# EAGLE design Xonik Noise A6 w.logo v2.1-12v (EAGLE 9.6.2)
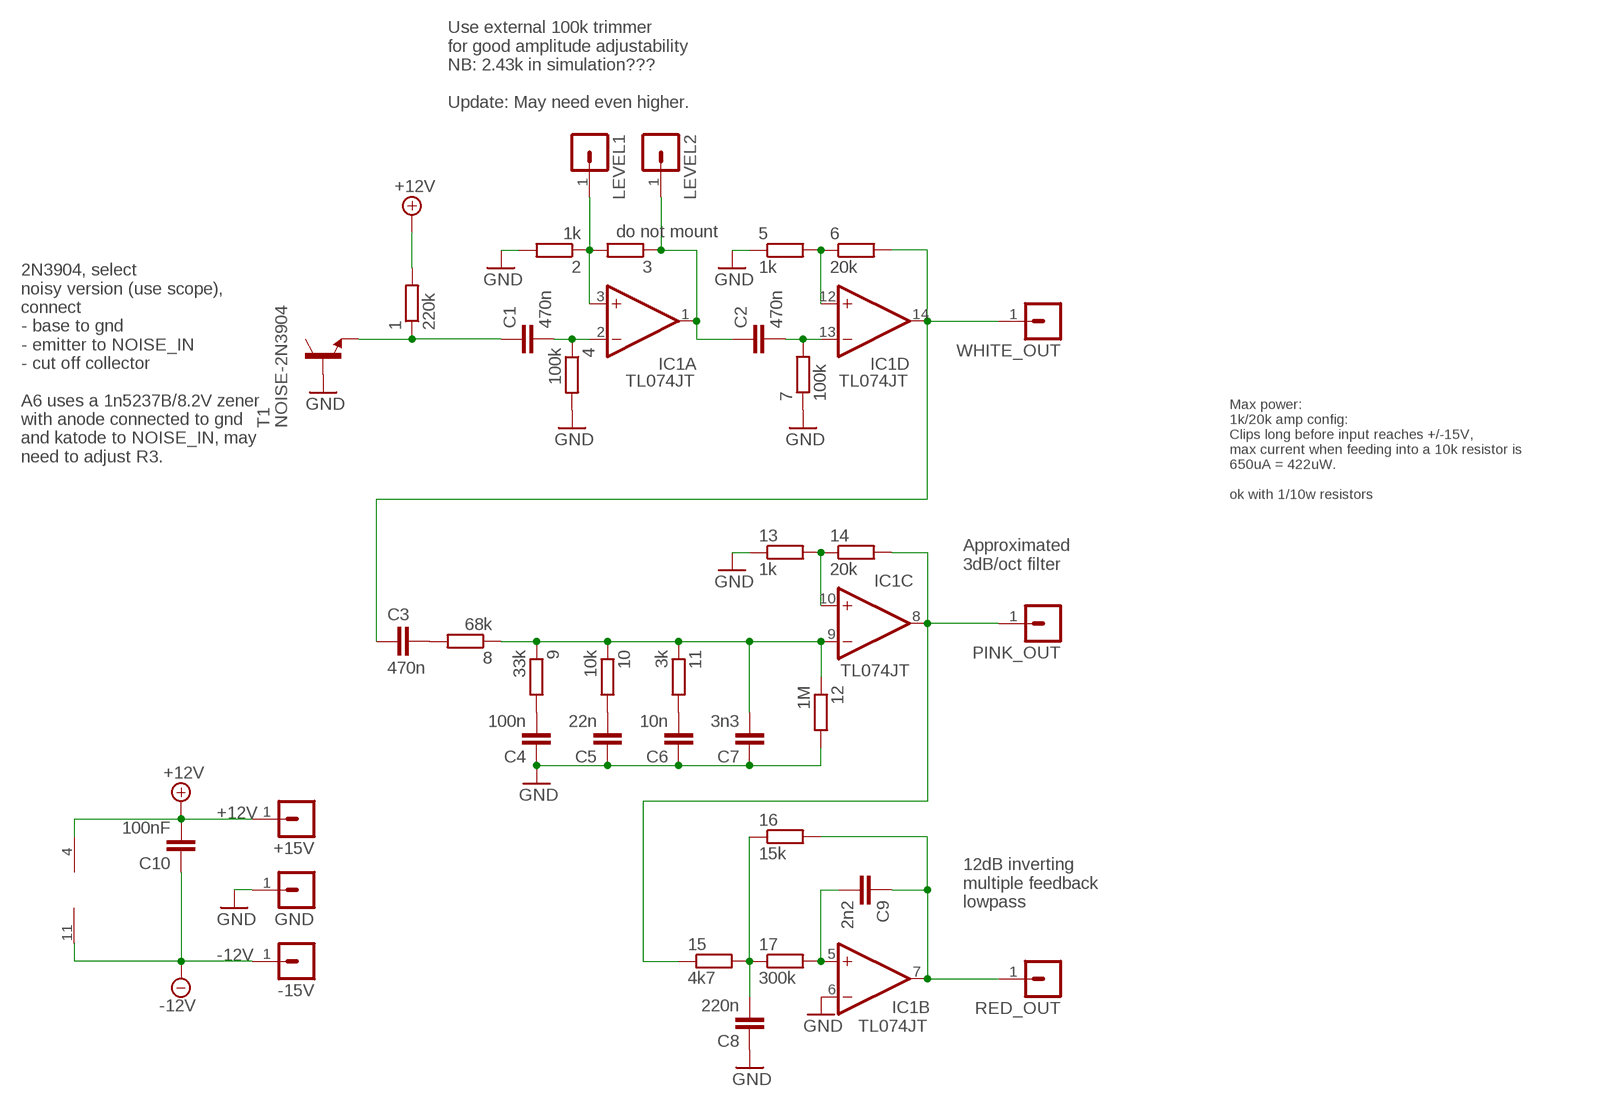
[diagram p0: schematic, sheet 1]

## Parts
1  220k  R-EU_R0603  [R0603]
2  1k  R-EU_R0603  [R0603]
3  do not mount  R-EU_R0603  [R0603]
4  100k  R-EU_R0603  [R0603]
5  1k  R-EU_R0603  [R0603]
6  20k  R-EU_R0603  [R0603]
7  100k  R-EU_R0603  [R0603]
8  68k  R-EU_R0603  [R0603]
9  33k  R-EU_R0603  [R0603]
10  10k  R-EU_R0603  [R0603]
11  3k  R-EU_R0603  [R0603]
12  1M  R-EU_R0603  [R0603]
13  1k  R-EU_R0603  [R0603]
14  20k  R-EU_R0603  [R0603]
15  4k7  R-EU_R0603  [R0603]
16  15k  R-EU_R0603  [R0603]
17  300k  R-EU_R0603  [R0603]
+15V  MA01-1JP  [SIP-PIN01-1J]
-15V  MA01-1JP  [SIP-PIN01-1J]
C1  470n  C-EUC0603  [C0603]
C2  470n  C-EUC0603  [C0603]
C3  470n  C-EUC0603  [C0603]
C4  100n  C-EUC0603  [C0603]
C5  22n  C-EUC0603  [C0603]
C6  10n  C-EUC0603  [C0603]
C7  3n3  C-EUC0603  [C0603]
C8  220n  C-EUC0603  [C0603]
C9  2n2  C-EUC0603  [C0603]
C10  100nF  C-EUC0603  [C0603]
GND  MA01-1JP  [SIP-PIN01-1J]
IC1  TL074JT  [TSSOP14J]
LEVEL1  MA01-1JP  [SIP-PIN01-1J]
LEVEL2  MA01-1JP  [SIP-PIN01-1J]
PINK_OUT  MA01-1JP  [SIP-PIN01-1J]
RED_OUT  MA01-1JP  [SIP-PIN01-1J]
T1  NOISE-2N3904  [NOISE-2N3904-J]
WHITE_OUT  MA01-1JP  [SIP-PIN01-1J]

## Nets
+12V: 1.2 +15V.1 C10.2 IC1.4(P:V+)
-12V: -15V.1 C10.1 IC1.11(P:V-)
GND: 2.2 4.2 5.1 7.1 12.2 13.1 C4.1 C5.1 C6.1 C7.1 C8.1 GND.1 IC1.6(B:-IN) T1.B
N$1: 2.1 3.2 IC1.3(A:+IN) LEVEL1.1
N$2: 5.2 6.1 IC1.12(D:+IN)
N$3: 13.2 14.1 IC1.10(C:+IN)
N$4: 9.2 C4.2
N$5: 10.2 C5.2
N$6: 11.2 C6.2
N$7: 1.1 C1.1 T1.E
N$8: 4.1 C1.2 IC1.2(A:-IN)
N$9: 3.1 C2.1 IC1.1(A:OUT) LEVEL2.1
N$10: 7.2 C2.2 IC1.13(D:-IN)
N$11: 6.2 C3.1 IC1.14(D:OUT) WHITE_OUT.1
N$12: 8.1 9.1 10.1 11.1 12.1 C7.2 IC1.9(C:-IN)
N$13: 8.2 C3.2
N$14: 14.2 15.1 IC1.8(C:OUT) PINK_OUT.1
N$16: 15.2 16.1 17.1 C8.2
N$17: 17.2 C9.2 IC1.5(B:+IN)
N$18: 16.2 C9.1 IC1.7(B:OUT) RED_OUT.1

## Notes on the sheet
- Use external 100k trimmer 
  for good amplitude adjustability
  NB: 2.43k in simulation???
  
  Update: May need even higher.
- 2N3904, select
  noisy version (use scope),
  connect 
  - base to gnd
  - emitter to NOISE_IN
  - cut off collector
  
  A6 uses a 1n5237B/8.2V zener
  with anode connected to gnd 
  and katode to NOISE_IN, may
  need to adjust R3.
- Max power:
  1k/20k amp config:
  Clips long before input reaches +/-15V,
  max current when feeding into a 10k resistor is
  650uA = 422uW. 
  
  ok with 1/10w resistors
- Approximated
  3dB/oct filter
- 12dB inverting
  multiple feedback
  lowpass

## Library data of the parts
1-17 = rcl:R-EU_: RESISTOR, European symbol; SPICEPREFIX: R
+15V -15V GND LEVEL1 LEVEL2 PINK_OUT RED_OUT WHITE_OUT = joakim:MA01-1J: PIN HEADER
C1-C10 = rcl:C-EU: CAPACITOR, European symbol; SPICEPREFIX: C
IC1 = joakim:TL074J: OP AMP
T1 = joakim:NOISE-2N3904: 2N3904 with the collector cut, used as a noise source

## Board
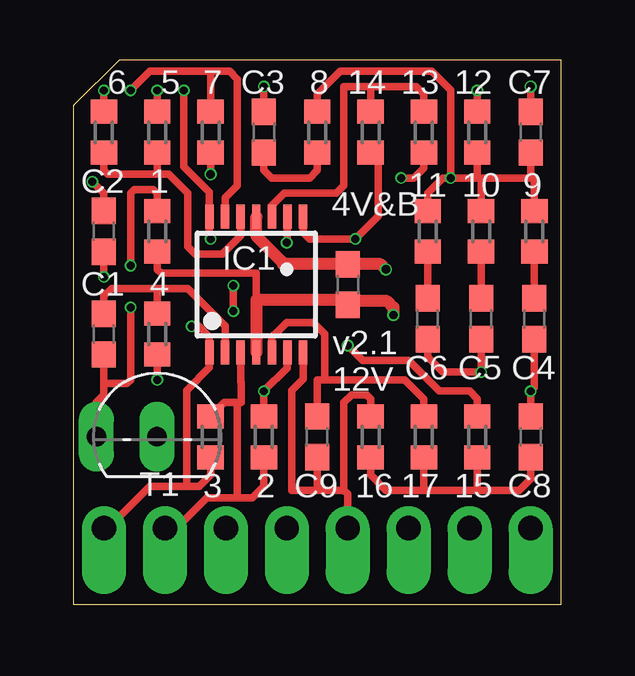
[diagram p1: board, top side]
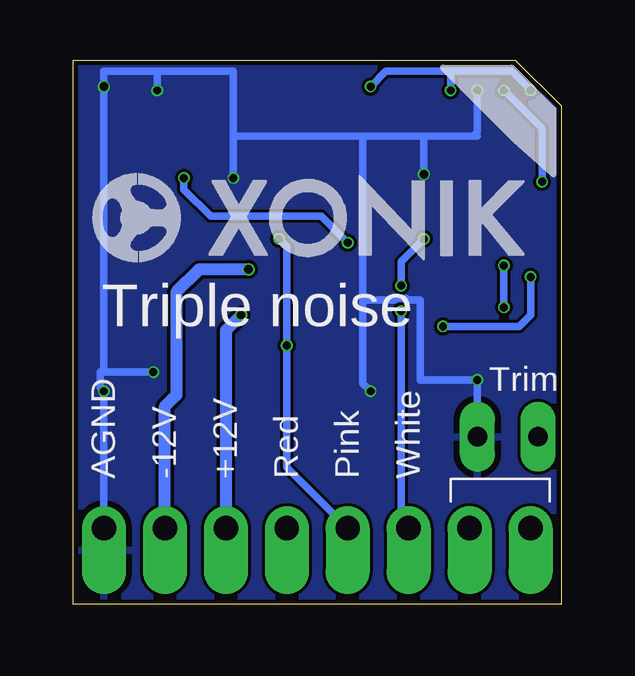
[diagram p2: board, bottom side, seen from below]

Size 20.32 x 22.7 mm. Coordinates in mm from the lower left corner, seen from the top.
Outline: 0,0 20.32,0 20.32,22.7 1.91,22.7 0,20.8 0,0
Copper layers (1*16): Top 0.035mm / dielectric 1.6mm / Bottom 0.035mm
Design rules "jlcpcb-2layers": minimum track width 5mil, minimum drill 0.3mm, track to track 5mil, track to pad 5mil, pad to pad 5mil, via to via 5mil, smd to smd 5mil, copper to edge 0.2mm, drill to drill 6mil, minimum pad ring 10mil, minimum via ring 3mil, stop-mask expansion 4mil, vias tented up to drill 0mil, thermal gap 10mil

### Footprints (pad centres in the part's own frame; a part is rotated, then mirrored left to right if it is on the bottom)
R0603 = smd 1 x 1.1: 1 -0.85,0; 2 0.85,0
SIP-PIN01-1J = drill 1.016 offset: 1 0,0
C0603 = smd 1.1 x 1: 1 -0.85,0; 2 0.85,0
TSSOP14J = smd 0.35 x 1: 1 -1.95,-2.825; 2 -1.3,-2.825; 3 -0.65,-2.825; 4 0,-2.825; 5 0.65,-2.825; 6 1.3,-2.825; 7 1.95,-2.825; 8 1.95,2.825; 9 1.3,2.825; 10 0.65,2.825; 11 0,2.825; 12 -0.65,2.825; 13 -1.3,2.825; 14 -1.95,2.825
NOISE-2N3904-J = drill 0.813 long: B 0,0; E -2.54,0

### Placement (x,y rotation side)
1  3.49,15.56 270 top
2  7.94,6.99 90 top
3  5.71,6.99 90 top
4  3.49,11.27 270 top
5  3.49,19.68 270 top
6  1.27,19.68 90 top
7  5.71,19.68 90 top
8  10.16,19.68 270 top
9  19.21,15.56 270 top
10  16.99,15.56 270 top
11  14.76,15.56 270 top
12  16.83,19.68 90 top
13  14.61,19.68 90 top
14  12.38,19.68 270 top
15  16.83,6.99 270 top
16  12.38,6.99 90 top
17  14.61,6.99 90 top
+15V  13.97,3.17 0 top
-15V  16.51,3.17 0 top
C1  1.27,11.27 90 top
C2  1.27,15.56 90 top
C3  7.94,19.68 270 top
C4  19.21,11.91 90 top
C5  16.99,11.91 90 top
C6  14.76,11.91 90 top
C7  19.05,19.68 270 top
C8  19.05,6.99 270 top
C9  10.16,6.99 90 top
C10  11.43,13.34 270 top
GND  19.05,3.17 0 top
IC1  7.62,13.34 0 top
LEVEL1  3.81,3.17 0 top
LEVEL2  1.27,3.17 0 top
PINK_OUT  8.89,3.17 0 top
RED_OUT  11.43,3.17 0 top
T1  3.49,6.99 0 top
U$1  [XONIK_LOGO_18]  19.53,14.29 0 bottom
WHITE_OUT  6.35,3.17 0 top

### Tracks (layer width: path | path; a pad name or v marks a point on that pad's centre or on a via)
+12V  (via drill 0.35)
  Top 0.305: 1.2 3.49,13.97 3.65,13.81 7.62,13.81 7.62,12.7
  Top 0.508: v13.34,12.06 13.34,12.38 13.07,12.64 11.59,12.64 C10.2 11.43,12.7 7.62,12.7 IC1.4
  Bottom 0.508: v13.34,12.06 13.97,11.43 +15V.1
-12V  (via drill 0.35)
  Top 0.508: IC1.11 7.62,15.37 8.73,14.26 8.73,14.19 C10.1 12.8,14.19 v13.02,13.97
  Bottom 0.508: -15V.1 16.51,8.26 16.03,8.73 16.03,13.02 15.08,13.97 v13.02,13.97
GND  (via drill 0.33, 0.35)
  Top 0.305: 2.2 v7.94,8.89 8.91,9.86 8.91,10 8.92,10.01 IC1.6 | v3.49,21.43 5.1 | v16.83,21.43 12.2 | v13.65,17.78 14.19,17.78 14.61,18.2 13.1 | 7.1 v5.71,17.94 | v19.05,21.59 C7.1 | C4.1 19.21,9.05 v19.05,8.89 C8.1 | C6.1 14.76,10.32 15.4,9.68 v16.99,9.68 C5.1 | 4.2 v3.49,9.37
  Bottom 0.305: 8.26,19.53 5.71,19.53 | 5.71,19.53 3.49,19.53 3.57,19.61 3.49,19.68 v3.49,21.43 | 8.26,19.53 8.26,12.7 | 8.26,12.7 8.26,9.21 v7.94,8.89 | 8.26,19.53 13.65,19.53 | 13.65,19.53 13.65,22.23 16.83,22.23 | 13.65,19.53 v13.65,17.78 | GND.1 v19.05,8.89 19.21,9.05 19.21,9.68 19.05,9.68 | 19.05,9.68 v19.05,21.59 19.05,22.23 16.83,22.23 | 16.83,22.23 v16.83,21.43 | v5.71,17.94 5.71,19.53 | 19.05,9.68 v16.99,9.68 | T1.B v3.49,9.37 5.87,9.37 5.87,12.7 6.41,12.7 6.45,12.74 6.88,12.74 6.93,12.7 8.26,12.7
  pour Bottom: 0,22.86 0,21.59 -0.32,21.27 -0.95,21.27 0,0 20.32,0 20.32,22.86
N$1
  Top 0.305: 6.83,4.45 7.46,4.45 7.94,4.92 2.1 | 6.83,4.45 5.56,4.45 4.29,3.17 LEVEL1.1 | 6.83,4.45 6.83,8.41 | 6.83,8.41 6.99,8.41 6.99,9.26 6.97,9.27 IC1.3 | 6.83,8.41 6.29,8.41 3.2
N$2
  Top 0.305: 3.49,17.94 5.2 | IC1.12 6.97,15.38 6.19,14.61 5.08,14.61 4.76,14.92 4.76,17.14 3.97,17.94 3.49,17.94 | 6.1 1.27,18.1 1.43,17.94 3.49,17.94
N$3
  Top 0.305: IC1.10 8.27,16.64 8.78,17.14 10.95,17.14 11.27,17.46 11.27,21.59 12.38,21.59 | 13.2 14.61,21.27 14.29,21.59 12.38,21.59 | 14.1 12.38,21.59
N$4
  Top 0.305: 9.2 C4.2
N$5
  Top 0.305: 10.2 C5.2
N$6
  Top 0.305: 11.2 C6.2
N$7  (via drill 0.33)
  Top 0.305: 1.1 3.49,17.14 3.33,17.3 2.54,17.3 2.38,17.14 v2.38,14.13 | v2.38,12.38 2.38,9.37 2.22,9.21 1.27,9.21 | T1.E 0.95,8.41 1.27,8.73 1.27,9.21 | 1.27,9.21 C1.1
  Bottom 0.305: v2.38,14.13 v2.38,12.38
N$8
  Top 0.305: IC1.2 6.33,11.6 4.76,13.18 3.49,13.18 | 3.49,13.18 4.1 | 3.49,13.18 1.59,13.18 1.27,12.86 C1.2
N$9  (via drill 0.33)
  Top 0.305: LEVEL2.1 1.43,3.17 3.17,4.92 4.72,4.92 | 4.72,4.92 5.24,4.92 5.71,5.4 3.1 | 4.72,4.92 4.72,8.92 5.67,9.88 IC1.1 5.67,11.16 5.24,11.59 v4.92,11.59 | C2.1 v1.27,13.65
  Bottom 0.305: v1.27,13.65 1.27,12.06 1.75,11.59 v4.92,11.59
N$10  (via drill 0.33)
  Top 0.305: 5.71,22.23 3.17,22.23 v2.38,21.43 | 5.71,22.23 6.51,22.23 6.83,21.91 6.83,17.46 6.32,16.96 IC1.13 | 7.2 5.71,22.23 | v0.79,17.62 1.27,17.14 C2.2
  Bottom 0.305: v2.38,21.43 0.79,19.84 v0.79,17.62
N$11  (via drill 0.33)
  Top 0.305: v7.94,21.59 C3.1 | v4.6,21.43 4.6,18.26 5.67,17.19 IC1.14 5.67,15.29 v5.71,15.24 | 6.2 v1.27,21.43 | v6.67,13.29 v6.67,12.22
  Bottom 0.305: v7.94,21.59 7.3,22.23 4.6,22.23 | v1.27,21.43 2.06,22.23 4.6,22.23 | 4.6,22.23 v4.6,21.43 | v5.71,15.24 6.67,14.29 v6.67,13.29 | WHITE_OUT.1 6.67,3.49 v6.67,12.22
N$12  (via drill 0.33)
  Top 0.305: IC1.9 8.92,15.11 v8.89,15.08 | C7.2 19.05,17.78 | 16.83,17.78 16.99,17.78 | 16.99,17.78 19.05,17.78 | 19.05,17.78 19.21,17.78 9.1 | 16.83,17.78 12.1 16.83,17.88 16.73,17.78 | 8.1 10.16,21.27 11.11,22.23 14.92,22.23 15.72,21.43 v15.72,17.78 | 11.1 14.76,17.14 15.4,17.78 v15.72,17.78 | v15.72,17.78 16.73,17.78 | 16.73,17.78 16.83,17.78 | 10.1 16.99,17.78
  Bottom 0.305: v15.72,17.78 15.72,17.3 14.61,16.19 10,16.19 v8.89,15.08
N$13
  Top 0.305: C3.2 7.94,18.1 8.26,17.78 9.84,17.78 10.16,18.1 8.2
N$14  (via drill 0.33)
  Top 0.305: 14.2 12.7,18.52 12.7,16.19 v11.75,15.24 9.84,15.24 9.57,15.51 IC1.8 | 15.1 16.83,8.57 16.51,8.89 15.24,8.89 13.97,10.16 12.06,10.16 v11.43,10.79
  Bottom 0.305: v11.75,15.24 11.43,14.92 v11.43,10.79 11.43,5.71 PINK_OUT.1
N$16
  Top 0.305: 16.1 12.38,5.4 13.02,4.76 14.61,4.76 | 17.1 14.61,4.76 | C8.2 19.05,5.24 18.57,4.76 16.83,4.76 | 14.61,4.76 16.83,4.76 | 15.2 16.83,4.76
N$17
  Top 0.305: 17.2 14.61,8.57 13.81,9.37 10.48,9.37 | IC1.5 8.27,11.14 8.56,11.43 8.88,11.75 10,11.75 10.48,11.27 10.48,9.37 | C9.2 10.16,9.37 10.48,9.37
N$18
  Top 0.305: IC1.7 9.57,9.4 9.09,8.92 9.09,4.76 10.16,4.76 | 10.16,4.76 11.27,4.76 | 16.2 12.38,8.57 12.22,8.73 11.59,8.73 11.27,8.41 11.27,4.76 | RED_OUT.1 11.43,4.6 11.27,4.76 | C9.1 10.16,4.76

### Text on the board
tNames: 4V&B | IC1 | v2.1 / 12V | T1
bNames: Triple noise | Trim | White | Pink | Red | +12V | -12V | AGND